# EAGLE schematic keychain_rev2 (EAGLE 9.5.2)
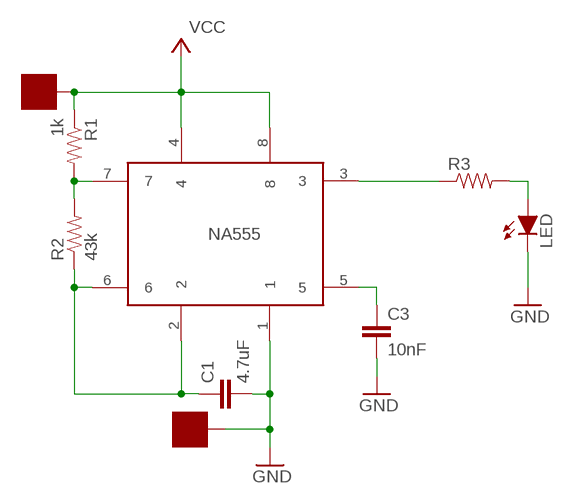
[diagram p0: schematic, sheet 1]

## Parts
5V  SOLDER_PAD  [SOLDER_PAD_XSMALL]
C1  4.7uF  CAP0603-CAP  [0603-CAP]
C3  10nF  CAP0603-CAP  [0603-CAP]
GND  SOLDER_PAD  [SOLDER_PAD_XSMALL]
LED  LED-0603  [LED-603]
NA555  NA555SO-8  [SOIC-08]
R1  1k  RESISTOR0603-RES  [0603-RES]
R2  43k  RESISTOR0603-RES  [0603-RES]
R3  RESISTOR0603  [0603-RES]

## Nets
GND: C1.2 C3.2 GND.P$1 LED.C NA555.1
N$1: LED.A R3.2
N$2: C1.1 NA555.2 NA555.6 R2.1
N$9: NA555.7 R1.2 R2.2
N$13: C3.1 NA555.5
RED: NA555.3 R3.1
VCC: 5V.P$1 NA555.4 NA555.8 R1.1

## Library data of the parts
5V GND = HyTechDevices:SOLDER_PAD: Solder pad used to attach wires directly to PCB
C1 C3 = HyTechDevices:CAP: Capacitor Standard 0603 ceramic capacitor, and 0.1" leaded capacitor.; TOLERANCE: 5%; VOLTAGE: 25V
LED = HyTechDevices:LED: Light Emitting Diode (LED) Source: Dangerous Prototypes Eagle Library <https://github.com/DangerousPrototypes/Eagle_Part_Library>
NA555 = HyTechDevices:NA555: Texas Instruments NA555 timer. Data sheet <http://www.ti.com/lit/ds/symlink/se555.pdf>
R1 R2 = HyTechDevices:RESISTOR: Resistor Basic schematic elements and footprints for 0603, 1206, and PTH resistors.; TOLERANCE: 1%
R3 = HyTechDevices:RESISTOR: Resistor Basic schematic elements and footprints for 0603, 1206, and PTH resistors.